# EAGLE design iBizi-V1A (EAGLE 6.5.0)
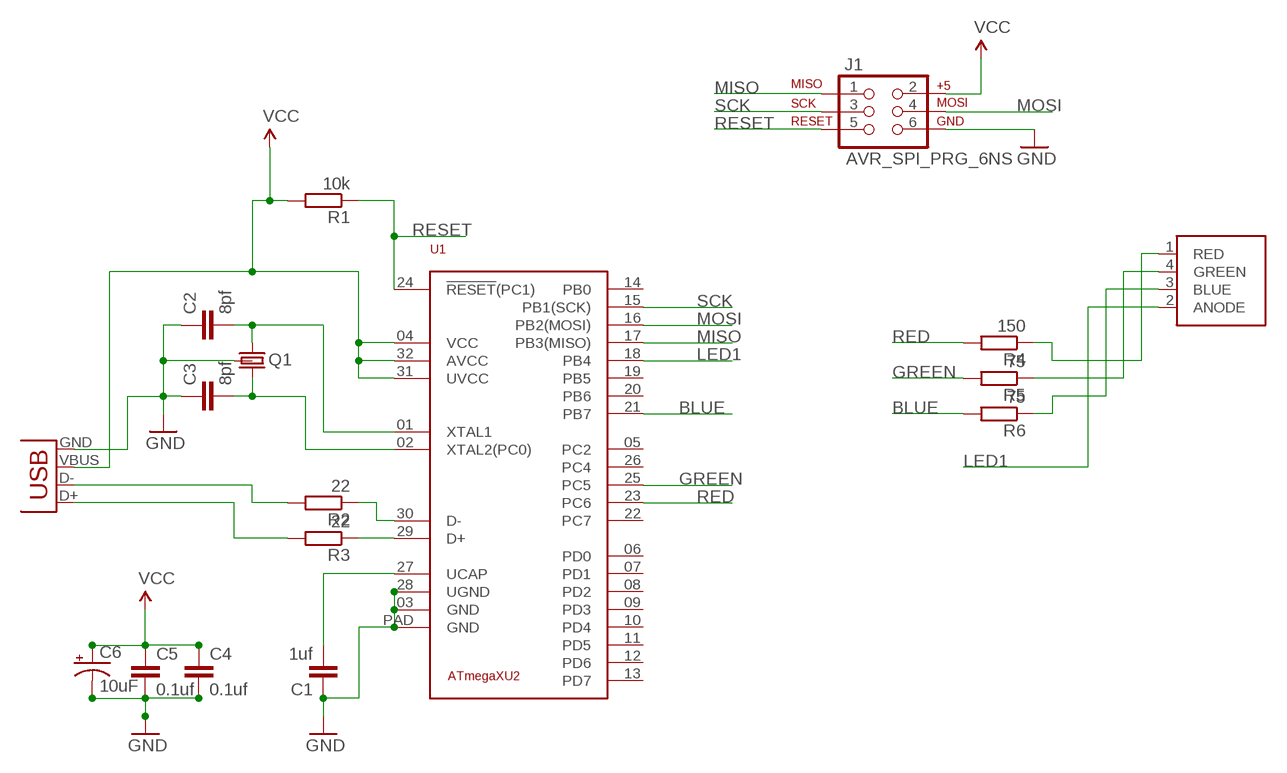
[diagram p0: schematic, sheet 1]

## Parts
C1  1uf  C-EUC0402  [C0402]
C2  8pf  C-EUC0402  [C0402]
C3  8pf  C-EUC0402  [C0402]
C4  0.1uf  C-EUC0402  [C0402]
C5  0.1uf  C-EUC0402  [C0402]
C6  10uF  10UF-16V-10%(TANT)  [EIA3216]
J1  AVR_SPI_PRG_6NS  [2X3-NS]
LED1  RGB-LED-CLV1A-FKB  [PLCC4]
Q1  CRYSTAL-EPSON-TSX3225-3.2X2.5  [CRYSTAL-SMD-3.2X2.5]
R1  10k  R-EU_R0402  [R0402]
R2  22  R-EU_R0402  [R0402]
R3  22  R-EU_R0402  [R0402]
R4  150  R-EU_R0402  [R0402]
R5  75  R-EU_R0402  [R0402]
R6  75  R-EU_R0402  [R0402]
U1  ATMEGAXU2  [QFN32]
USB  USBSMD  [USB-MINIB]

## Nets
BLUE: R6.2 U1.21(PB7)
GND: C1.1 C2.1 C3.1 C4.2 C5.2 C6.C(-) J1.6 Q1.2(GND) Q1.4(GND) U1.03(GND) U1.28(UGND) U1.PAD(GND) USB.GND
GREEN: R5.2 U1.25(PC5)
LED1: LED1.2(ANODE) U1.18(PB4)
MISO: J1.1 U1.17(PB3(MISO))
MOSI: J1.4 U1.16(PB2(MOSI))
N$1: C2.2 Q1.1 U1.01(XTAL1)
N$2: C3.2 Q1.3 U1.02(XTAL2(PC0))
N$3: R3.1 U1.29(D+)
N$4: R3.2 USB.D+
N$5: R2.1 U1.30(D-)
N$6: R2.2 USB.D-
N$7: LED1.1(RED) R4.1
N$8: LED1.4(GREEN) R5.1
N$9: LED1.3(BLUE) R6.1
N$10: C1.2 U1.27(UCAP)
RED: R4.2 U1.23(PC6)
RESET: J1.5 R1.1 U1.24(!RESET!(PC1))
SCK: J1.3 U1.15(PB1(SCK))
VCC: C4.1 C5.1 C6.A(+) J1.2 R1.2 U1.04(VCC) U1.31(UVCC) U1.32(AVCC) USB.VBUS
Unconnected: U1.05(PC2) U1.06(PD0) U1.07(PD1) U1.08(PD2) U1.09(PD3) U1.10(PD4) U1.11(PD5) U1.12(PD6) U1.13(PD7) U1.14(PB0) U1.19(PB5) U1.20(PB6) U1.22(PC7) U1.26(PC4)

## Library data of the parts
C1-C5 = resistor:C-EU: CAPACITOR, European symbol
C6 = SparkFun-Capacitors:10UF-16V-10%(TANT): CAP-00811 1206/EIA-3216 Tantalum capacitor; PROD_ID: CAP-00811
J1 = SparkFun-Connectors:AVR_SPI_PRG_6: AVR ISP 6 Pin This is the reduced ISP connector for AVR programming. Common on Arduino. This footprint will take up less PCB space and can be used with a 10-pin to 6-pin adapter such as SKU: BOB-08508
LED1 = Transistorlabs:RGB-LED-CLV1A-FKB
Q1 = Transistorlabs:CRYSTAL-EPSON-TSX3225-3.2X2.5
R1-R6 = resistor:R-EU_: RESISTOR, European symbol
U1 = Transistorlabs:ATMEGAXU2
USB = SparkFun-Connectors:USB: USB Connectors USB-B-PTH is fully proven SKU : PRT-00139/CONN-08278 USB-miniB is fully proven SKU : PRT-00587 USB-A-PCB is untested. USB-A-H is throughly reviewed, but untested. Spark Fun Electronics SKU : PRT-00437 USB-B-SMT is throughly reviewed, but untested. Needs silkscreen touching up. USB-A-S has not been used/tested USB-MB-H has not been used/tested USB-MICROB has been used. CONN-09505

## Board
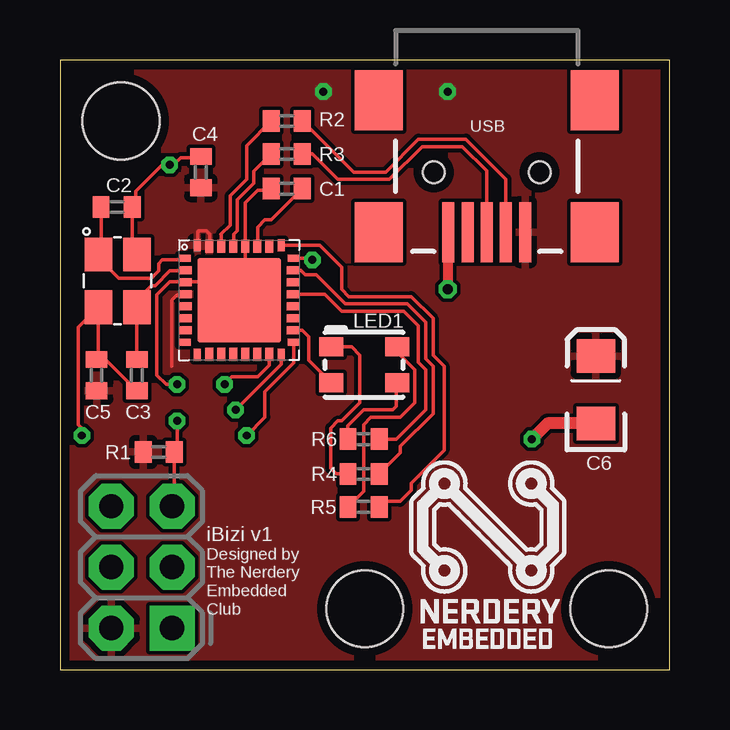
[diagram p1: board, top side]
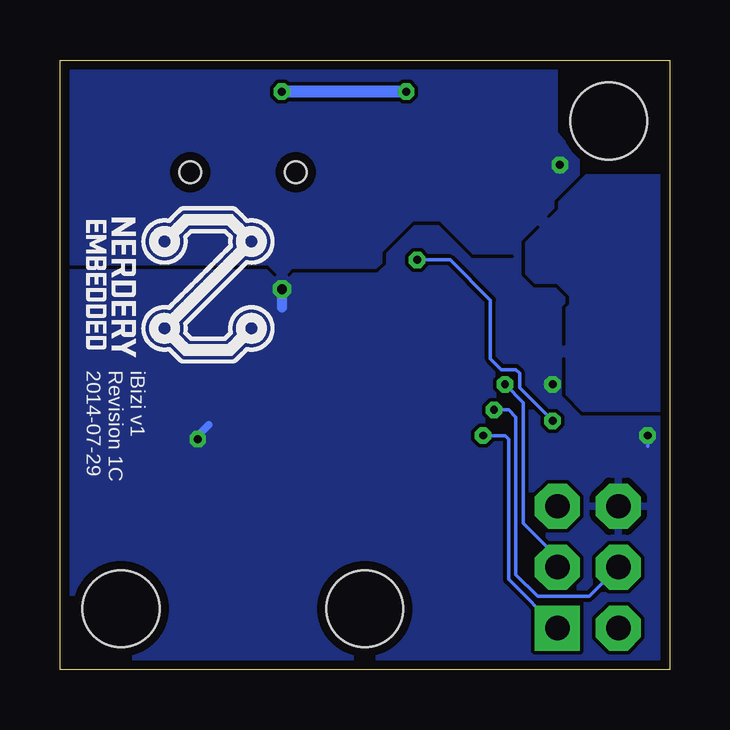
[diagram p2: board, bottom side, seen from below]

Size 25.4 x 25.4 mm. Coordinates in mm from the lower left corner, seen from the top.
Outline: 0,0 25.4,0 25.4,25.4 0,25.4 0,0
Copper layers (1*16): Top 0.0356mm / dielectric 1.5011mm / Bottom 0.0356mm
Design rules "LaenPCBOrder *": minimum track width 6mil, minimum drill 13mil, track to track 6mil, track to pad 6mil, pad to pad 6mil, via to via 6mil, smd to smd 6mil, copper to edge 15mil, drill to drill 6mil, minimum pad ring 7mil, minimum via ring 7mil, stop-mask expansion 3mil, vias tented up to drill 0mil, thermal gap 10mil
Holes 3.2 mm at 22.86,2.54 12.7,2.54 2.54,22.86
bRestrict: 29 lines

### Footprints (pad centres in the part's own frame; a part is rotated, then mirrored left to right if it is on the bottom)
C0402 = smd 0.7 x 0.9: 1 -0.65,0; 2 0.65,0
EIA3216 = smd 1.4 x 1.6: A 1.4,0; C -1.4,0
2X3-NS = drill 1.016 pad 1.88 square: 1 -2.54,-1.27 | drill 1.016 pad 1.88 octagon: 2 -2.54,1.27; 3 0,-1.27; 4 0,1.27; 5 2.54,-1.27; 6 2.54,1.27
PLCC4 = smd 1 x 0.8: 1 -1.4,0.75; 2 -1.4,-0.75; 3 1.35,-0.75; 4 1.35,0.75
CRYSTAL-SMD-3.2X2.5 = smd 1.4 x 1.15: 1 0,0; 2 2.2,0; 3 2.2,1.6; 4 0,1.6
R0402 = smd 0.7 x 0.9: 1 -0.65,0; 2 0.65,0
QFN32 = smd 0.5 x 0.3: 01 -2.28,1.75; 08 -2.28,-1.75; 17 2.28,-1.75; 24 2.28,1.75 | smd 0.55 x 0.325: 02 -2.25,1.25; 03 -2.25,0.75; 04 -2.25,0.25; 05 -2.25,-0.25; 06 -2.25,-0.75; 07 -2.25,-1.25; 18 2.25,-1.25; 19 2.25,-0.75; 20 2.25,-0.25; 21 2.25,0.25; 22 2.25,0.75; 23 2.25,1.25 | smd 0.3 x 0.5: 09 -1.75,-2.28; 16 1.75,-2.28; 25 1.75,2.28; 32 -1.75,2.28 | smd 0.325 x 0.55: 10 -1.25,-2.25; 11 -0.75,-2.25; 12 -0.25,-2.25; 13 0.25,-2.25; 14 0.75,-2.25; 15 1.25,-2.25; 26 1.25,2.25; 27 0.75,2.25; 28 0.25,2.25; 29 -0.25,2.25; 30 -0.75,2.25; 31 -1.25,2.25 | smd 3.5 x 3.5: PAD 0,0
USB-MINIB = smd 2.5 x 0.5: D+ 2.5,0; D- 2.5,0.8; GND 2.5,-1.6; ID 2.5,-0.8; VBUS 2.5,1.6 | smd 2.5 x 2: MTN1 -3,4.5; MTN2 2.5,4.5; MTN3 -3,-4.5; MTN4 2.5,-4.5 | hole 0.9: 0,2.2; 0,-2.2

### Placement (x,y rotation side)
C1  9.45,20.04 0 top
C2  2.36,19.28 180 top
C3  3.2,12.27 90 top
C4  5.87,20.73 90 top
C5  1.52,12.27 90 top
C6  22.33,11.66 90 top
J1  3.4,4.27 90 top
LED1  12.7,12.7 0 top
Q1  1.6,17.3 270 top
R1  4.11,9.07 180 top
R2  9.45,22.86 0 top
R3  9.45,21.49 0 top
R4  12.65,8.15 0 top
R5  12.65,6.78 0 top
R6  12.65,9.6 0 top
U1  7.47,15.39 0 top
USB  17.78,20.73 270 top

### Tracks (layer width: path | path; a pad name or v marks a point on that pad's centre or on a via)
BLUE
  Top 0.152: U1.21 11.03,15.64 11.73,14.94 14.33,14.94 14.94,14.33 14.94,12.8 15.24,12.5 15.24,10.82 14.02,9.6 R6.2
GND  (via drill 0.33, 0.41)
  Top 0.152: C4.2 5.83,21.34 5.03,21.34 4.72,21.03 v4.57,21.03 4.27,21.03 3.17,19.93 3.17,19.43 C2.1 3.01,17.48 Q1.4 | 6.4,16.15 5.23,16.15 U1.03 5.21,16.15 4.57,16.15 4.04,15.62 4.04,12.27 4.42,11.89 v4.88,11.89 | 6.4,16.15 7.16,15.39 U1.PAD | C1.1 8.72,19.96 8.23,19.96 7.72,19.45 U1.28 7.72,16.15 6.4,16.15 | v0.91,9.75 0.91,10.06 0.76,10.21 0.76,14.26 Q1.2 1.6,12.99 C5.2 1.9,12.92 C3.1 3.39,11.62
  Top 0.406: USB.GND 16.15,18.2 v16.15,15.85
  Top 0.508: C6.C 20.32,10.26 v19.66,9.6
  Bottom 0.152: v4.57,21.03 4.57,20.73 | v0.91,9.75 0.91,9.3 | v4.88,11.89 5.18,11.89
  Bottom 0.305: v19.66,9.6 19.66,9.75 19.2,10.21
  Bottom 0.406: v16.15,15.85 16.15,15.09
  pour Bottom: 0,25.45 25.45,25.45 25.45,25.3 25.3,25.3 25.3,0 0,0
GREEN
  Top 0.152: U1.25 10.83,17.67 11.73,16.76 11.73,15.85 12.04,15.54 14.63,15.54 15.54,14.63 15.54,13.11 16,12.65 16,9.14 14.63,7.77 14.63,7.47 14.17,7.01 13.53,7.01 R5.2
LED1
  Top 0.152: LED1.2 10.36,12.89 10.36,13.87 10.09,14.14 U1.18
MISO  (via drill 0.33)
  Top 0.152: U1.17 9.75,12.8 8.53,11.58 8.53,10.52 v7.77,9.75
  Bottom 0.152: J1.1 6.71,3.76 6.71,9.6 6.86,9.75 v7.77,9.75
MOSI  (via drill 0.33)
  Top 0.152: v7.32,10.82 9.22,12.72 U1.16
  Bottom 0.152: J1.4 3.35,3.05 5.49,3.05 6.4,3.96 6.4,10.52 6.71,10.82 v7.32,10.82
N$1
  Top 0.152: U1.01 5.11,17.07 4.27,17.07 4.12,16.92 4.12,16.61 3.81,16.31 2.44,16.31 1.6,17.14 Q1.1 1.71,17.41 C2.2
N$2
  Top 0.152: U1.02 5.19,16.61 4.57,16.61 3.96,16 3.81,16 3.2,15.39 Q1.3 C3.2 | C3.2
N$3
  Top 0.152: U1.29 7.24,17.66 7.24,18.14 7.39,18.29 7.39,19.58 8.08,20.27 8.08,20.77 R3.1
N$4
  Top 0.152: R3.2 10.52,21.49 11.58,20.42 13.72,20.42 15.09,21.79 16.76,21.79 17.78,20.78 USB.D+
N$5
  Top 0.152: U1.30 6.72,18.12 6.71,18.14 7.09,18.52 7.09,19.74 7.77,20.42 7.77,21.83 R2.1
N$6
  Top 0.152: R2.2 12.23,20.73 13.56,20.73 14.94,22.1 16.92,22.1 18.58,20.43 USB.D-
N$7
  Top 0.152: R4.1 11.51,8.15 11.28,8.38 11.28,10.06 11.58,10.36 11.73,10.36 12.5,11.12 12.5,13.11 12.15,13.45 LED1.1
N$8
  Top 0.152: R5.1 12.65,7.43 12.65,10.21 12.95,10.52 14.17,10.52 14.78,11.12 14.78,12.5 14.05,13.23 LED1.4
N$9
  Top 0.152: R6.1 12,10.17 12.65,10.82 13.87,10.82 14.02,10.97 14.02,11.92 LED1.3
N$10
  Top 0.152: U1.27 8.23,18.44 8.53,18.75 8.8,18.75 C1.2
RED
  Top 0.152: R4.2 14.17,9.03 14.17,9.3 15.54,10.67 15.54,12.65 15.24,12.95 15.24,14.48 14.48,15.24 11.89,15.24 10.67,16.46 10.21,16.46 10.03,16.64 U1.23
RESET  (via drill 0.33)
  Top 0.152: J1.5 4.76,6.9 R1.1 4.88,9.18 v4.88,10.36 | v10.52,17.07 10.44,17.14 U1.24
  Bottom 0.152: v4.88,10.36 6.25,11.73 6.25,12.34 6.4,12.5 7.01,12.5 7.47,12.95 7.47,15.39 9.14,17.07 v10.52,17.07
SCK  (via drill 0.33)
  Top 0.152: v6.86,11.89 7.16,12.19 8.23,12.19 8.72,12.68 U1.15
  Bottom 0.152: J1.3 4.67,4.67 6.1,6.1 6.1,11.12 v6.86,11.89
VCC  (via drill 0.33)
  Top 0.152: U1.32 5.75,17.64 5.75,18.24 5.79,18.29 6.1,18.29 6.25,18.14 6.25,17.67 U1.31 | U1.04 5.2,15.62 4.88,15.62 4.65,15.39 4.65,12.65
  Bottom 0.508: v10.97,24.08 v16.15,24.08
  pour Top: -0.46,25.91 25.91,25.91 25.91,-0.46 -0.46,-0.46

### Text on the board
tPlace: iBizi v1 | Designed by / The Nerdery / Embedded / Club | C:/Share/embeddedclublogo1.bmp
bPlace: iBizi v1 / Revision 1C / 2014-07-29